# Altium project pca10112.PrjPCB (part 3 of 5)

## Sheet pca10112_sheet6_connectors.SchDoc: PCA10112 - Connectors
size A3; Organization: Nordic Semiconductor; DocumentNumber: 6; Revision: 1.1.0; SheetNumber: 6; SheetTotal: 8; Author: HANY; CompanyName: Nordic Semiconductor; ProjectName: pca10112.PrjPCB
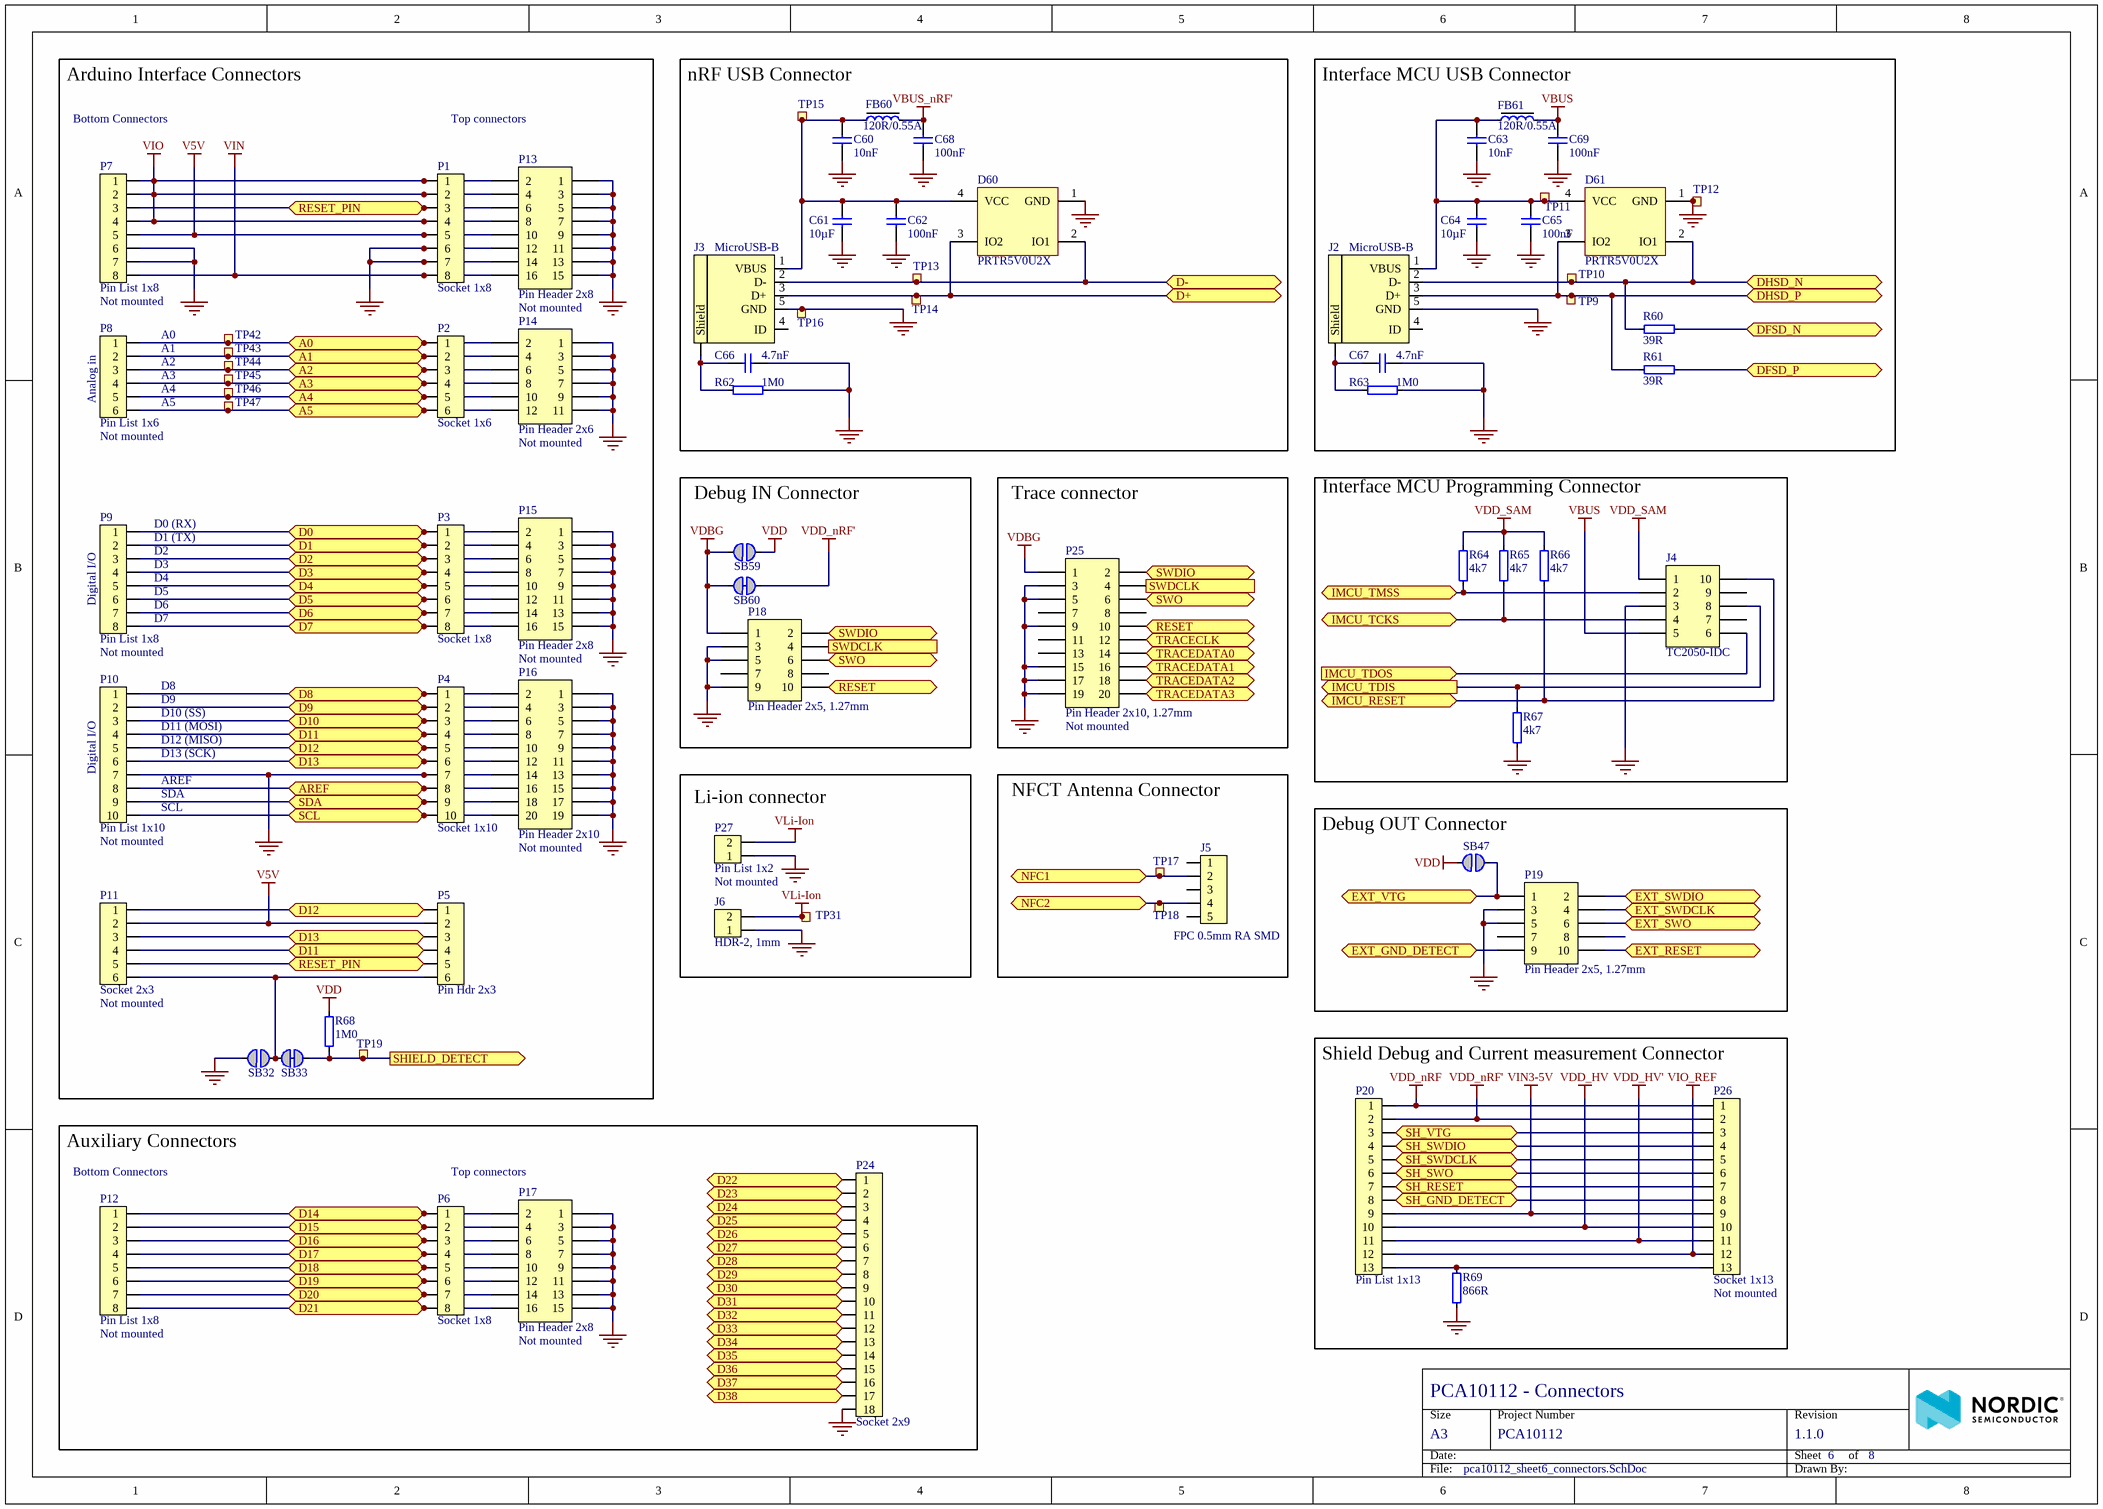
[diagram p5: pca10112_sheet6_connectors.SchDoc]

### Parts
C60  10nF  [CAPC0603X03L_C]
C61  10µF  [CAPC1608X06L]
C62  100nF  [CAPC0603X03L_C]
C63  10nF  [CAPC0603X03L_C]
C64  10µF  [CAPC1608X06L]
C65  100nF  [CAPC0603X03L_C]
C66  4.7nF  [CAPC0603X03L_C]
C67  4.7nF  [CAPC0603X03L_C]
C68  100nF  [CAPC0603X03L_C]
C69  100nF  [CAPC0603X03L_C]
D60  PRTR5V0U2X  [SOT190P230X110-4L]
D61  PRTR5V0U2X  [SOT190P230X110-4L]
FB60  120R/0.55A  [INDC1005X04L]
FB61  120R/0.55A  [INDC1005X04L]
J2  MicroUSB-B  [USB-Micro-B-RA-SMD-PiP]
J3  MicroUSB-B  [USB-Micro-B-RA-SMD-PiP]
J4  TC2050-IDC  [TC2050-IDC-NLFP]  (no BOM)
J5  FPC 0.5mm RA SMD  [FPC_05P-0.5mm-RA-SMD]
J6  HDR-2, 1mm  [SM02B-SRSS-TB]
P1  Socket 1x8  [SOCKET_1x8_SMD]
P2  Socket 1x6  [SOCKET_1x6_SMD]
P3  Socket 1x8  [SOCKET_1x8_SMD]
P4  Socket 1x10  [SOCKET_1x10_SMD]
P5  Pin Hdr 2x3  [HDR_2x3-SMD]
P6  Socket 1x8  [SOCKET_1x8_SMD]
P7  Pin List 1x8  Assembly: Not mounted  [LIST_1x8_SMD-NC]
P8  Pin List 1x6  Assembly: Not mounted  [LIST_1x6_SMD-NC]
P9  Pin List 1x8  Assembly: Not mounted  [LIST_1x8_SMD-NC]
P10  Pin List 1x10  Assembly: Not mounted  [LIST_1x10_SMD-NC]
P11  Socket 2x3  Assembly: Not mounted  [SOCKET_2x3_SMD-2.54mm-bottom-NC]
P12  Pin List 1x8  Assembly: Not mounted  [LIST_1x8_SMD-NC]
P13  Pin Header 2x8  Assembly: Not mounted  [HDR_2x8-NC]
P14  Pin Header 2x6  Assembly: Not mounted  [HDR_2x6-NC]
P15  Pin Header 2x8  Assembly: Not mounted  [HDR_2x8-NC]
P16  Pin Header 2x10  Assembly: Not mounted  [HDR_2x10-NC]
P17  Pin Header 2x8  Assembly: Not mounted  [HDR_2x8-NC]
P18  Pin Header 2x5, 1.27mm  [HDR_2x5-SMD-1.27mm-K]
P19  Pin Header 2x5, 1.27mm  [HDR_2x5-SMD-1.27mm-K]
P20  Pin List 1x13  [LIST_1x13_SMD]
P24  Socket 2x9  [SOCKET_2x9_SMD-2.54mm]
P25  Pin Header 2x10, 1.27mm  Assembly: Not mounted  [HDR_2x10-SMD-1.27mm-NC]
P26  Socket 1x13  Assembly: Not mounted  [LIST_1x13_SMD-NC]
P27  Pin List 1x2  Assembly: Not mounted  [LIST_1x2-NC]
R60  39R  [RESC0603X03L_C]
R61  39R  [RESC0603X03L_C]
R62  1M0  [RESC0603X03L_C]
R63  1M0  [RESC0603X03L_C]
R64  4k7  [RESC0603X03L_C]
R65  4k7  [RESC0603X03L_C]
R66  4k7  [RESC0603X03L_C]
R67  4k7  [RESC0603X03L_C]
R68  1M0  [RESC0603X03L_C]
R69  866R  [RESC0603X03L_C]
SB32  Solderbridge  [Solderbridge]  (value not drawn)  (no BOM)
SB33  Solderbridge  [Solderbridge_Shorted]  (value not drawn)  (net tie, no BOM)
SB47  Solderbridge  [Solderbridge]  (value not drawn)  (no BOM)
SB59  Solderbridge  [Solderbridge]  (value not drawn)  (no BOM)
SB60  Solderbridge  [Solderbridge_Shorted]  (value not drawn)  (net tie, no BOM)
TP9  Ø1.0mm,SMD  [TP_SMD_Ø1.0mm]  (value not drawn)  (no BOM)
TP10  Ø1.0mm,SMD  [TP_SMD_Ø1.0mm]  (value not drawn)  (no BOM)
TP11  Ø1.0mm,SMD  [TP_SMD_Ø1.0mm]  (value not drawn)  (no BOM)
TP12  Ø1.0mm,SMD  [TP_SMD_Ø1.0mm]  (value not drawn)  (no BOM)
TP13  Ø1.5mm,SMD  [TP_SMD_Ø1.5mm]  (value not drawn)  (no BOM)
TP14  Ø1.5mm,SMD  [TP_SMD_Ø1.5mm]  (value not drawn)  (no BOM)
TP15  Ø1.5mm,SMD  [TP_SMD_Ø1.5mm]  (value not drawn)  (no BOM)
TP16  Ø1.5mm,SMD  [TP_SMD_Ø1.5mm]  (value not drawn)  (no BOM)
TP17  Ø1.0mm,SMD  [TP_SMD_Ø1.0mm]  (value not drawn)  (no BOM)
TP18  Ø1.0mm,SMD  [TP_SMD_Ø1.0mm]  (value not drawn)  (no BOM)
TP19  Ø1.0mm,SMD  [TP_SMD_Ø1.0mm]  (value not drawn)  (no BOM)
TP31  Ø1.0mm,SMD  [TP_SMD_Ø1.0mm]  (value not drawn)  (no BOM)
TP42  Ø1.0mm,SMD  [TP_SMD_Ø1.0mm]  (value not drawn)  (no BOM)
TP43  Ø1.0mm,SMD  [TP_SMD_Ø1.0mm]  (value not drawn)  (no BOM)
TP44  Ø1.0mm,SMD  [TP_SMD_Ø1.0mm]  (value not drawn)  (no BOM)
TP45  Ø1.0mm,SMD  [TP_SMD_Ø1.0mm]  (value not drawn)  (no BOM)
TP46  Ø1.0mm,SMD  [TP_SMD_Ø1.0mm]  (value not drawn)  (no BOM)
TP47  Ø1.0mm,SMD  [TP_SMD_Ø1.0mm]  (value not drawn)  (no BOM)

### Blocks framed on the sheet
Arduino Interface Connectors: P1-P5 P7-P11 P13-P16 R68 SB32 SB33 TP19 TP42-TP47
nRF USB Connector: C60-C62 C66 C68 D60 FB60 J3 R62 TP13-TP16
Interface MCU USB Connector: C63-C65 C67 C69 D61 FB61 J2 R60 R61 R63 TP9-TP12
Debug IN Connector: P18 SB59 SB60
Trace connector: P25
Interface MCU Programming Connector: J4 R64-R67
Li-ion connector: J6 P27 TP31
NFCT Antenna Connector: J5 TP17 TP18
Debug OUT Connector: P19 SB47
Shield Debug and Current measurement Connector: P20 P26 R69
Auxiliary Connectors: P6 P12 P17 P24

### Ports
A0 (bidir), A1 (bidir), A2 (bidir), A3 (bidir), A4 (bidir), A5 (bidir), AREF (bidir), D0 (bidir), D1 (bidir), D2 (bidir), D3 (bidir), D4 (bidir), D5 (bidir), D6 (bidir), D7 (bidir), D8 (bidir), D9 (bidir), D10 (bidir), D11 (bidir), D12 (bidir), D13 (bidir), D14 (bidir), D15 (bidir), D16 (bidir), D17 (bidir), D18 (bidir), D19 (bidir), D20 (bidir), D21 (bidir), D22 (bidir), D23 (bidir), D24 (bidir), D25 (bidir), D26 (bidir), D27 (bidir), D28 (bidir), D29 (bidir), D30 (bidir), D31 (bidir), D32 (bidir), D33 (bidir), D34 (bidir), D35 (bidir), D36 (bidir), D37 (bidir), D38 (bidir), D+ (bidir), D- (bidir), DFSD_N (bidir), DFSD_P (bidir), DHSD_N (bidir), DHSD_P (bidir), EXT_GND_DETECT (bidir), EXT_RESET (bidir), EXT_SWDCLK (bidir), EXT_SWDIO (bidir), EXT_SWO (bidir), EXT_VTG (bidir), IMCU_RESET (bidir), IMCU_TCKS (bidir), IMCU_TDIS (out), IMCU_TDOS (in), IMCU_TMSS (bidir), NFC1 (bidir), NFC2 (bidir), RESET (bidir), RESET_PIN (bidir), SCL (bidir), SDA (bidir), SH_GND_DETECT (bidir), SH_RESET (bidir), SH_SWDCLK (bidir), SH_SWDIO (bidir), SH_SWO (bidir), SH_VTG (bidir), SHIELD_DETECT (out), SWDCLK (out), SWDIO (bidir), SWO (bidir), TRACECLK (bidir), TRACEDATA0 (bidir), TRACEDATA1 (bidir), TRACEDATA2 (bidir), TRACEDATA3 (bidir)

### Nets
GND: C60.1 C61.1 C62.1 C63.2 C64.1 C65.1 C66.1 C67.1 C68.1 C69.1 D60.1(GND) D61.1(GND) J2.5(GND) J3.5(GND) J4.3 J6.1 P1.6 P1.7 P4.7 P7.6 P7.7 P10.7 P13.1 P13.3 P13.5 P13.7 P13.9 P13.11 P13.12 P13.13 P13.14 P13.15 P14.1 P14.3 P14.5 P14.7 P14.9 P14.11 P15.1 P15.3 P15.5 P15.7 P15.9 P15.11 P15.13 P15.15 P16.1 P16.3 P16.5 P16.7 P16.9 P16.11 P16.13 P16.14 P16.15 P16.17 P16.19 P17.1 P17.3 P17.5 P17.7 P17.9 P17.11 P17.13 P17.15 P18.3 P18.5 P18.9 P19.3 P19.5 P24.18 P25.3 P25.5 P25.9 P25.15 P25.17 P25.19 P27.1 R62.1 R63.1 R67.2 R69.1 SB32.1 TP12.1 TP16.1
V5V: P1.5 P5.2 P7.5 P11.2 P13.10
VBUS: C69.2 FB61.2 J4.5
VBUS_nRF': C68.2 FB60.2
VDBG: P18.1 P25.1 SB59.1 SB60.1
VDD: R68.2 SB47.1 SB59.2
VDD_HV: P20.10 P26.10
VDD_HV': P20.11 P26.11
VDD_nRF: P20.1 P26.1
VDD_nRF': P20.2 P26.2 SB60.2
VDD_SAM: J4.1 R64.2 R65.2 R66.2
VIN: P1.8 P7.8 P13.16
VIN3-5V: P20.9 P26.9
VIO: P1.1 P1.2 P1.4 P7.1 P7.2 P7.4 P13.2 P13.4 P13.8
VIO_REF: P20.12 P26.12
VLi-Ion: J6.2 P27.2 TP31.1
D20: P6.7 P12.7 P17.14 ; port D20
D21: P6.8 P12.8 P17.16 ; port D21
D_N: D60.2(IO1) J3.2(D-) TP13.1 ; port D-
D_P: D60.3(IO2) J3.3(D+) TP14.1 ; port D+
DFSD_N: R60.1 ; port DFSD_N
DFSD_P: R61.1 ; port DFSD_P
DHSD_N: D61.2(IO1) J2.2(D-) R60.2 TP10.1 ; port DHSD_N
DHSD_P: D61.3(IO2) J2.3(D+) R61.2 TP9.1 ; port DHSD_P
EXT_GND_DETECT: P19.9 ; port EXT_GND_DETECT
EXT_RESET: P19.10 ; port EXT_RESET
EXT_SWDCLK: P19.4 ; port EXT_SWDCLK
EXT_SWDIO: P19.2 ; port EXT_SWDIO
EXT_SWO: P19.6 ; port EXT_SWO
EXT_VTG: P19.1 SB47.2 ; port EXT_VTG
IMCU_RESET: J4.10 R66.1 ; port IMCU_RESET
IMCU_TCKS: J4.4 R65.1 ; port IMCU_TCKS
IMCU_TDIS: J4.8 R67.1 ; port IMCU_TDIS
IMCU_TDOS: J4.6 ; port IMCU_TDOS
IMCU_TMSS: J4.2 R64.1 ; port IMCU_TMSS
NFC1: J5.2 TP17.1 ; port NFC1
NFC2: J5.4 TP18.1 ; port NFC2
P0.00: P6.1 P12.1 P17.2 ; port D14
P0.01: P6.2 P12.2 P17.4 ; port D15
P0.02/AIN0: P4.8 P10.8 P16.16 ; port AREF
P0.03/AIN1: P2.1 P8.1 P14.2 TP42.1 ; port A0
P0.04/AIN2: P2.2 P8.2 P14.4 TP43.1 ; port A1
P0.05/AIN3: P6.3 P12.3 P17.6 ; port D16
P0.06: P6.4 P12.4 P17.8 ; port D17
P0.07: P6.5 P12.5 P17.10 P25.12 ; port D18, port TRACECLK
P0.08: P6.6 P12.6 P17.12 ; port D19
P0.11: P24.1 P25.18 ; port D22, port TRACEDATA2
P0.12: P24.2 P25.16 ; port D23, port TRACEDATA1
P0.13: P24.3 ; port D24
P0.14: P24.4 ; port D25
P0.15: P24.5 ; port D26
P0.16: P24.6 ; port D27
P0.17: P24.7 ; port D28
P0.18/RESET: P18.10 P24.8 P25.10 ; port RESET, port D29
P0.19: P24.9 ; port D30
P0.20: P24.10 ; port D31
P0.21: P24.11 ; port D32
P0.22: P24.12 ; port D33
P0.23: P24.13 ; port D34
P0.24: P24.14 ; port D35
P0.25: P24.15 ; port D36
P0.28/AIN4: P2.3 P8.3 P14.6 TP44.1 ; port A2
P0.29/AIN5: P2.4 P8.4 P14.8 TP45.1 ; port A3
P0.30/AIN6: P2.5 P8.5 P14.10 TP46.1 ; port A4
P0.31/AIN7: P2.6 P8.6 P14.12 TP47.1 ; port A5
P1.00: P18.6 P24.16 P25.6 P25.14 ; port SWO, port D37, port TRACEDATA0
P1.01: P3.1 P9.1 P15.2 ; port D0
P1.02: P3.2 P9.2 P15.4 ; port D1
P1.03: P3.3 P9.3 P15.6 ; port D2
P1.04: P3.4 P9.4 P15.8 ; port D3
P1.05: P3.5 P9.5 P15.10 ; port D4
P1.06: P3.6 P9.6 P15.12 ; port D5
P1.07: P3.7 P9.7 P15.14 ; port D6
P1.08: P3.8 P9.8 P15.16 ; port D7
P1.09: P24.17 P25.20 ; port D38, port TRACEDATA3
P1.10: P4.1 P10.1 P16.2 ; port D8
P1.11: P4.2 P10.2 P16.4 ; port D9
P1.12: P4.3 P10.3 P16.6 ; port D10
P1.13: P4.4 P5.4 P10.4 P11.4 P16.8 ; port D11
P1.14: P4.5 P5.1 P10.5 P11.1 P16.10 ; port D12
P1.15: P4.6 P5.3 P10.6 P11.3 P16.12 ; port D13
RESET_PIN: P1.3 P5.5 P7.3 P11.5 P13.6 ; port RESET_PIN
SCL: P4.10 P10.10 P16.20 ; port SCL
SDA: P4.9 P10.9 P16.18 ; port SDA
SH_GND_DETECT: P20.8 P26.8 ; port SH_GND_DETECT
SH_RESET: P20.7 P26.7 ; port SH_RESET
SH_SWDCLK: P20.5 P26.5 ; port SH_SWDCLK
SH_SWDIO: P20.4 P26.4 ; port SH_SWDIO
SH_SWO: P20.6 P26.6 ; port SH_SWO
SH_VTG: P20.3 P26.3 ; port SH_VTG
SHIELD_DETECT: R68.1 SB33.2 TP19.1 ; port SHIELD_DETECT
SWDCLK: P18.4 P25.4 ; port SWDCLK
SWDIO: P18.2 P25.2 ; port SWDIO
NetC60_2: C60.2 C61.2 C62.2 D60.4(VCC) FB60.1 J3.1(VBUS) TP15.1
NetC63_1: C63.1 C64.2 C65.2 D61.4(VCC) FB61.1 J2.1(VBUS) TP11.1
NetC66_2: C66.2 J3.6(Shield) R62.2
NetC67_2: C67.2 J2.6(Shield) R63.2
NetP5_6: P5.6 P11.6 SB32.2 SB33.1
NetP20_13: P20.13 P26.13 R69.2

Not connected (* = marked no-connect by the designer): J2 4(ID); J3 4(ID); J4 7 9; J5 1 3 5; P18 7 8; P19 7 8; P25 7 8 11 13

### Notes on the sheet
- Bottom Connectors
- Top connectors
- (near P8) A0
- (near P8) A1
- (near P8) A2
- (near P8) A3
- (near P8) Analog in
- (near P8) A4
- (near P8) A5
- (near P9) D0 (RX)
- (near P9) D1 (TX)
- (near P9) D2
- (near P9) D3
- (near P9) D4
- (near P9) Digital I/O
- (near P9) D5
- (near P9) D6
- (near P9) D7
- (near P10) D8
- (near P10) D9
- (near P10) D10 (SS)
- (near P10) Digital I/O
- (near P10) AREF
- (near P10) D11 (MOSI)
- (near P10) D12 (MISO)
- (near P10) D13 (SCK)
- (near P10) SDA
- (near P10) SCL
- (near P12) Bottom Connectors
- Size
- Date:
- Project Number
- Sheet         of
- Revision
- File:
- Drawn By:

### Library data of the parts
C60 C63 = C0201-10n: Capacitor, X7R, ±10%; Manufacturer: N.A.; Part number IPS: 00000003480; Note: 10V; Pad Count: 2; Part Number: C0201-10n; Manufacturer Part Number: N.A.; LatestRevisionDate: 2017-11-09; Pin Count: 2; Publisher: Nordic Semiconductor; Published: 2014-11-13; Value: 10nF; Artikkelnr Noca: N.A.; Footprint Doc: 0201; ComponentLink1URL: N.A.; ComponentLink1Description: Datasheet; ComponentLink2URL: N.A.; ComponentLink2Description: Supplier link; HelpURL: N.A.; Supplier 1: N.A.; Supplier Part Number 1: N.A.; Supplier 2: N.A.; Supplier Part Number 2: N.A.; Component Class: Capacitors; PartId: 100200067; Author: rsk; Part number Norautron: N.A.
C61 C64 = C0603-10µ: Capacitor, X5R, ±20%; Manufacturer: N.A.; Part number IPS: 00000007785; Note: 6.3V; Artikkelnr Noca: 20039234; Pad Count: 2; Part Number: C0603-10µ; Manufacturer Part Number: N.A.; LatestRevisionDate: 2011-01-17; Pin Count: 2; Publisher: Nordic Semiconductor; Published: 2011-01-17; Value: 10µF; Footprint Doc: 0603; ComponentLink1URL: N.A.; ComponentLink1Description: Datasheet; ComponentLink2URL: N.A.; ComponentLink2Description: Supplier link; HelpURL: N.A.; Supplier 1: N.A.; Supplier Part Number 1: N.A.; Supplier 2: N.A.; Supplier Part Number 2: N.A.; Component Class: Capacitors; PartId: 100200275; Author: rsk; Part number Norautron: N.A.
C62 C65 C68 C69 = C0201-100n: Capacitor, X5R, ±10%; Manufacturer: N.A.; Part number IPS: 00000001248, 00000002505; Note: 16V; Pad Count: 2; Part Number: C0201-100n; Manufacturer Part Number: N.A.; LatestRevisionDate: 2017-11-09; Pin Count: 2; Publisher: Nordic Semiconductor; Published: 2014-11-13; Value: 100nF; Artikkelnr Noca: N.A.; Footprint Doc: 0201; ComponentLink1URL: N.A.; ComponentLink1Description: Datasheet; ComponentLink2URL: N.A.; ComponentLink2Description: Supplier link; HelpURL: N.A.; Supplier 1: N.A.; Supplier Part Number 1: N.A.; Supplier 2: N.A.; Supplier Part Number 2: N.A.; Component Class: Capacitors; PartId: 100200078; Author: rsk; Part number Norautron: N.A.
C66 C67 = C0201-4n7: Chip Cap 0201; Manufacturer: N.A.; Part number IPS: 00000001243; Note: Chip Cap 1%; Pad Count: 2; Part Number: C0201-4n7; Manufacturer Part Number: N.A.; LatestRevisionDate: 2020-10-13; Pin Count: 2; Publisher: Nordic Semiconductor; Published: 2014-11-13; Value: 4.7nF; Artikkelnr Noca: N.A.; Footprint Doc: 0201; ComponentLink1URL: N.A.; ComponentLink1Description: Datasheet; ComponentLink2URL: N.A.; ComponentLink2Description: Supplier link; HelpURL: N.A.; Supplier 1: N.A.; Supplier Part Number 1: N.A.; Supplier 2: N.A.; Supplier Part Number 2: N.A.; Component Class: Capacitors; PartId: 100200063; Author: rsk; Part number Norautron: N.A.
D60 D61 = PRTR5V0U2X: Ultra low capacitance double rail-to-rail ESD protection diode; Manufacturer: NXP Semiconductors; Part number IPS: 00000009951; Note: N.A.; Artikkelnr Noca: 10069015; Pad Count: 4; Part Number: PRTR5V0U2X; Manufacturer Part Number: PRTR5V0U2X; LatestRevisionDate: 2017-11-09; Publisher: Nordic Semiconductor; Published: 2012-06-11; Value: PRTR5V0U2X; Footprint Doc: SOT-143B; ComponentLink1URL: N.A.; ComponentLink1Description: Datasheet; ComponentLink2URL: N.A.; ComponentLink2Description: Supplier link; HelpURL: http://www.farnell.com/datasheets/109718.pdf; Pin Count: 4; Supplier 1: Digi-Key; Supplier Part Number 1: 568-4140-1-ND; Supplier 2: Farnell; Supplier Part Number 2: 152-4157; Component Class: Semiconductors; PartId: 101300082; Author: rsk; Part number Norautron: N.A.
FB60 FB61 = FB0402-120R@100M-500mA: Ferrite Bead, 120 Ohm @ 100MHz, 500mA, 250 mOhm Max; Manufacturer: Murata; Manufacturer Part Number: BLM15AG121SN1D; Part number IPS: 00000009954; Part number Norautron: N.A.; Note: Chip EMIFIL Inductor Type Chip Ferrite Bead; Artikkelnr Noca: 33029317; Pad Count: 2; Part Number: FB0402-120R@100M-500mA; Footprint Doc: 0402; LatestRevisionDate: 2014-01-10; Pin Count: 2; Publisher: Nordic Semiconductor; Published: 2011-11-14; Value: 120R/0.55A; ComponentLink1Description: Datasheet; ComponentLink2Description: Supplier link; ComponentLink1URL: N.A.; ComponentLink2URL: N.A.; HelpURL: http://search.murata.co.jp/Ceramy/image/img/PDF/ENG/L0110S0100BLM15A_SN.pdf; Supplier 1: Digi-Key; Supplier Part Number 1: 490-1005-1-ND; Supplier 2: Farnell; Supplier Part Number 2: 151-5760; Component Class: Inductors; PartId: 100300099; Author: rsk
J2 J3 = USB-Micro-B-RA-SMD-PiP: MicroUSB-B-SMT; Manufacturer: Allen Creations Corp.; Manufacturer Part Number: AJU55-BS2111-L; Part number IPS: 00000007790; Note: N.A.; Artikkelnr Noca: 55029020; Pad Count: 5; Part Number: USB-Micro-B-RA-SMD-PiP; Footprint Doc: USB-Micro-B-RA-SMD-PiP; LatestRevisionDate: 2016-04-21; Pin Count: 5; Publisher: Nordic Semiconductor; Published: 2014-10-07; Value: MicroUSB-B; ComponentLink1URL: N.A.; ComponentLink1Description: Datasheet; ComponentLink2URL: N.A.; ComponentLink2Description: Supplier link; HelpURL: \\hizz\pro\app9717\Datasheet\connectors\Allen Creations Corp\AJU-211.pdf; Supplier 1: Cabcon; Supplier Part Number 1: AJU55-BS2111-L; Supplier 2: Digi-Key; Supplier Part Number 2: 609-4616-1-ND; Component Class: Connectors; PartId: 100500490; Author: rsk; Part number Norautron: N.A.
J4 = TC2050-IDC-NLFP: CBL PLUG-OF-NAILS 10-PIN; Manufacturer: Tag-Connect LLC; Artikkelnr Noca: N.A.; Pad Count: 10; Part Number: TC2050-IDC-NLFP; Manufacturer Part Number: TC2050-IDC-NLFP; LatestRevisionDate: 2012-11-21; Publisher: Nordic Semiconductor; Published: 2012-11-21; Value: TC2050-IDC; Pin Count: 10; Footprint Doc: TC2050-IDC-NLFP; Part number IPS: N.A.; ComponentLink1URL: N.A.; ComponentLink1Description: Datasheet; ComponentLink2URL: N.A.; ComponentLink2Description: Supplier link; HelpURL: http://www.tag-connect.com/Materials/TC2050-IDC%20Datasheet.pdf; Supplier 1: Digi-Key; Supplier Part Number 1: TC2050-IDC-NL-ND; Supplier 2: N.A.; Supplier Part Number 2: N.A.; Component Class: Connectors; Note: N.A.; PartId: 100500463; Author: rsk; Part number Norautron: N.A.
J5 = FPC_05P-0.5mm-RA-SMD: 0.5mm FPC, 5P,Right Angle SMT,Double Contact,H=1.2mm,White, Tin plated; Manufacturer: W-CON; Manufacturer Part Number: 5141-05RZDNWR01; Part number IPS: 00000007792; Note: N.A.; Artikkelnr Noca: 55010020; Pad Count: 7; Part Number: FPC_05P-0.5mm-RA-SMD; Footprint Doc: FPC_05P-0.5mm-RA-SMD; LatestRevisionDate: 2016-04-21; Pin Count: 7; Publisher: Nordic Semiconductor; Published: 2015-06-22; Value: FPC 0.5mm RA SMD; ComponentLink1URL: N.A.; ComponentLink1Description: Datasheet; ComponentLink2URL: N.A.; ComponentLink2Description: Supplier link; HelpURL: \\hizz\pro\app9717\Datasheet\connectors\W-CON\5141-XXRZDNXX0X.pdf; Supplier 1: Cabcon; Supplier Part Number 1: 5141-05RZDNWR01; Supplier 2: Digi-Key; Supplier Part Number 2: WM9836CT-ND; Component Class: Connectors; PartId: 100500528; Author: rsk; Part number Norautron: N.A.
J6 = SM02B-SRSS-TB: 1.0mm pitch connector side entry SMD; Manufacturer: JST Sales America Inc.; Manufacturer Part Number: SM02B-SRSS-TB(LF)(SN); Part number IPS: 00000007791; Part number Norautron: N.A.; Note: JST, Header; Artikkelnr Noca: 55010030; Pad Count: 2; Part Number: SM02B-SRSS-TB; Footprint Doc: SM02B-SRSS-TB; LatestRevisionDate: 2016-06-20; Pin Count: 2; Publisher: Nordic Semiconductor; Published: 2016-06-20; Value: HDR-2, 1mm; ComponentLink1URL: N.A.; ComponentLink1Description: Datasheet; ComponentLink2URL: N.A.; ComponentLink2Description: Supplier link; HelpURL: http://www.jst-mfg.com/product/pdf/eng/eSH.pdf; Supplier 1: Cabcon; Supplier Part Number 1: SM02B-SRSS-TB(LF)(SN); Supplier 2: Digi-Key; Supplier Part Number 2: 455-1802-1-ND; Component Class: Connectors; PartId: 100500383; Author: rsk
P1 P3 P6 = Socket 1x8 SMD: Socket 1x8, 2.54mm (100mil), SMD; Manufacturer: W-CON; Manufacturer Part Number: 2171-108MS0CUNR1; Part number IPS: 00000009963; Note: N.A.; Artikkelnr Noca: 55030002; Pad Count: 8; Part Number: Socket 1x8 SMD; Footprint Doc: SOCKET_1x8_SMD; LatestRevisionDate: 2017-10-23; Pin Count: 8; Publisher: Nordic Semiconductor; Published: 2016-01-22; Value: Socket 1x8; ComponentLink1URL: N.A.; ComponentLink1Description: Datasheet; ComponentLink2URL: N.A.; ComponentLink2Description: Supplier link; HelpURL: N.A.; Supplier 1: Cabcon; Supplier Part Number 1: 2171-108MS0CUNR1; Supplier 2: Samtec; Supplier Part Number 2: SSM-108-F-SV-P-TR; Component Class: Connectors; PartId: 100500412; Author: rsk; Part number Norautron: N.A.
P2 = Socket 1x6 SMD: Socket 1x6, 2.54mm (100mil), SMD; Manufacturer: W-CON; Manufacturer Part Number: 2171-106MS0CUNR1; Part number IPS: 00000009964; Note: N.A.; Artikkelnr Noca: 55030001; Pad Count: 6; Part Number: Socket 1x6 SMD; Footprint Doc: SOCKET_1x6_SMD; LatestRevisionDate: 2017-10-23; Pin Count: 6; Publisher: Nordic Semiconductor; Published: 2016-01-22; Value: Socket 1x6; ComponentLink1URL: N.A.; ComponentLink1Description: Datasheet; ComponentLink2URL: N.A.; ComponentLink2Description: Supplier link; HelpURL: N.A.; Supplier 1: Cabcon; Supplier Part Number 1: 2171-106MS0CUNR1; Supplier 2: Samtec; Supplier Part Number 2: SSM-106-F-SV-P-TR; Component Class: Connectors; PartId: 100500408; Author: rsk; Part number Norautron: N.A.
P4 = Socket 1x10 SMD: Socket 1x10, 2.54mm (100mil), SMD; Manufacturer: W-CON; Manufacturer Part Number: 2171-110MS0CUNR1; Part number IPS: 00000009965; Note: N.A.; Artikkelnr Noca: 55030004; Pad Count: 10; Part Number: Socket 1x10 SMD; Footprint Doc: SOCKET_1x10_SMD; LatestRevisionDate: 2016-01-22; Pin Count: 10; Publisher: Nordic Semiconductor; Published: 2016-01-22; Value: Socket 1x10; ComponentLink1URL: N.A.; ComponentLink1Description: Datasheet; ComponentLink2URL: N.A.; ComponentLink2Description: Supplier link; HelpURL: N.A.; Supplier 1: Cabcon; Supplier Part Number 1: 2171-110MS0CUNR1; Supplier 2: Samtec; Supplier Part Number 2: SSM-110-F-SV-P-TR; Component Class: Connectors; PartId: 100500416; Author: rsk; Part number Norautron: N.A.
P5 = Pin Header 2x3 SMD: Pin Header 2x3, 2.54mm (100mil) SMD; Manufacturer: W-CON; Manufacturer Part Number: 1125-1203S0M116R1; Part number IPS: 00000009966; Part number Norautron: N.A.; Artikkelnr Noca: 55010007; Pad Count: 6; Part Number: Pin Header 2x3 SMD; Footprint Doc: HDR_2x3-SMD; LatestRevisionDate: 2016-01-22; Pin Count: 6; Publisher: Nordic Semiconductor; Published: 2016-01-22; Value: Pin Hdr 2x3; Note: SMD; ComponentLink1URL: N.A.; ComponentLink1Description: Datasheet; ComponentLink2URL: N.A.; ComponentLink2Description: Supplier link; HelpURL: \\hizz\pro\app9717\Datasheet\connectors\W-CON\1125-12XXXXMXXXXX.PDF; Supplier 1: Cabcon; Supplier Part Number 1: 1125-1203S0M116R1; Supplier 2: Samtec; Supplier Part Number 2: TSM-103-01-L-DV; Component Class: Connectors; PartId: 100500242; Author: rsk
P7 P9 P12 = Pin List 1x8 SMD, N.C.: Pin List 1x8, 2.54mm (100mil), SMD; Manufacturer: W-CON; Manufacturer Part Number: 1125-1108S0M116R2; Note: N.A.; Artikkelnr Noca: 55010006; Pad Count: 8; Part Number: Pin List 1x8 SMD, N.C.; LatestRevisionDate: 2016-01-22; Publisher: Nordic Semiconductor; Published: 2016-01-22; Value: Pin List 1x8; Pin Count: 8; Footprint Doc: LIST_1x8_SMD; Part number IPS: N.A.; ComponentLink1URL: N.A.; ComponentLink1Description: Datasheet; ComponentLink2URL: N.A.; ComponentLink2Description: Supplier link; HelpURL: \\hizz\pro\app9717\Datasheet\connectors\W-CON\1125-11XXXXMXXXXX.pdf; Supplier 1: Cabcon; Supplier Part Number 1: 1125-1108S0M116R2; Supplier 2: Samtec; Supplier Part Number 2: TSM-108-01-L-SV-P-TR; Component Class: Connectors; PartId: 100500330; Author: rsk; Part number Norautron: N.A.
P8 = Pin List 1x6 SMD, N.C.: Pin List 1x6, 2.54mm (100mil), SMD; Manufacturer: W-CON; Manufacturer Part Number: 1125-1106S0M116R2; Note: N.A.; Artikkelnr Noca: 55010026; Pad Count: 6; Part Number: Pin List 1x6 SMD, N.C.; LatestRevisionDate: 2016-03-29; Pin Count: 6; Publisher: Nordic Semiconductor; Published: 2016-03-29; Value: Pin List 1x6; Footprint Doc: LIST_1x6_SMD; Part number IPS: N.A.; ComponentLink1URL: N.A.; ComponentLink1Description: Datasheet; ComponentLink2URL: N.A.; ComponentLink2Description: Supplier link; HelpURL: \\hizz\pro\app9717\Datasheet\connectors\W-CON\1125-11XXXXMXXXXX.pdf; Supplier 1: Cabcon; Supplier Part Number 1: 1125-1106S0M116R2; Supplier 2: Samtec; Supplier Part Number 2: TSM-106-01-L-SV-P-TR; Component Class: Connectors; PartId: 100500321; Author: rsk; Part number Norautron: N.A.
P10 = Pin List 1x10 SMD, N.C.: Pin List 1x10, 2.54mm (100mil), SMD; Manufacturer: W-CON; Manufacturer Part Number: 1125-1110S0M116R2; Note: N.A.; Artikkelnr Noca: 55010028; Pad Count: 10; Part Number: Pin List 1x10 SMD, N.C.; LatestRevisionDate: 2016-03-29; Publisher: Nordic Semiconductor; Published: 2016-03-29; Value: Pin List 1x10; Pin Count: 10; Footprint Doc: LIST_1x10_SMD; Part number IPS: N.A.; ComponentLink1URL: N.A.; ComponentLink1Description: Datasheet; ComponentLink2URL: N.A.; ComponentLink2Description: Supplier link; HelpURL: \\hizz\pro\app9717\Datasheet\connectors\W-CON\1125-11XXXXMXXXXX.pdf; Supplier 1: Cabcon; Supplier Part Number 1: 1125-1110S0M116R2; Supplier 2: Samtec; Supplier Part Number 2: TSM-110-01-L-SV-P-TR; Component Class: Connectors; PartId: 100500338; Author: rsk; Part number Norautron: N.A.
P11 = Socket 2x3 SMD Bottom, N.C.: Socket 2x3, 2.54mm (100mil), SMD; Manufacturer: W-CON; Manufacturer Part Number: 2171-203MS0CUNR1; Note: N.A.; Artikkelnr Noca: 55030010; Pad Count: 6; Part Number: Socket 2x3 SMD Bottom, N.C.; LatestRevisionDate: 2016-03-29; Pin Count: 6; Publisher: Nordic Semiconductor; Published: 2014-06-10; Value: Socket 2x3; Footprint Doc: SOCKET_2x3_SMD-2.54mm-bottom; Part number IPS: N.A.; ComponentLink1URL: N.A.; ComponentLink1Description: Datasheet; ComponentLink2URL: N.A.; ComponentLink2Description: Supplier link; HelpURL: \\hizz\pro\app9717\Datasheet\connectors\W-CON\2171-2XXMXXCUNXX.pdf; Supplier 1: Cabcon; Supplier Part Number 1: 2171-203MS0CUNR1; Supplier 2: Samtec; Supplier Part Number 2: SSM-103-F-DV-P-TR; Component Class: Connectors; PartId: 100500434; Author: rsk; Part number Norautron: N.A.
P13 P15 P17 = Pin Header 2x8, N.C.: Pin Header 2x8, 2.54mm (100mil); Manufacturer: N.A.; Pad Count: 16; Part Number: Pin Header 2x8, N.C.; Manufacturer Part Number: N.A.; Footprint Doc: HDR_2x8; LatestRevisionDate: 2009-12-12; Pin Count: 16; Publisher: Nordic Semiconductor; Published: 2009-12-12; Value: Pin Header 2x8; Note: N.A.; Artikkelnr Noca: N.A.; Part number IPS: N.A.; ComponentLink1URL: N.A.; ComponentLink1Description: Datasheet; ComponentLink2URL: N.A.; ComponentLink2Description: Supplier link; HelpURL: N.A.; Supplier 1: N.A.; Supplier Part Number 1: N.A.; Supplier 2: N.A.; Supplier Part Number 2: N.A.; Component Class: Connectors; PartId: 100500270; Author: rsk; Part number Norautron: N.A.
P14 = Pin Header 2x6, N.C.: Pin Header 2x6, 2.54mm (100mil); Manufacturer: N.A.; Pad Count: 12; Part Number: Pin Header 2x6, N.C.; Manufacturer Part Number: N.A.; Footprint Doc: HDR_2x6; LatestRevisionDate: 2014-07-04; Pin Count: 12; Publisher: Nordic Semiconductor; Published: 2009-12-12; Value: Pin Header 2x6; Note: N.A.; Artikkelnr Noca: N.A.; Part number IPS: N.A.; ComponentLink1URL: N.A.; ComponentLink1Description: Datasheet; ComponentLink2URL: N.A.; ComponentLink2Description: Supplier link; HelpURL: N.A.; Supplier 1: N.A.; Supplier Part Number 1: N.A.; Supplier 2: N.A.; Supplier Part Number 2: N.A.; Component Class: Connectors; PartId: 100500265; Author: rsk; Part number Norautron: N.A.
P16 = Pin Header 2x10, N.C.: Pin Header 2x10, 2.54mm (100mil); Manufacturer: N.A.; Pad Count: 20; Part Number: Pin Header 2x10, N.C.; Manufacturer Part Number: N.A.; Footprint Doc: HDR_2x10; LatestRevisionDate: 2017-02-02; Pin Count: 20; Publisher: Nordic Semiconductor; Published: 2017-01-30; Value: Pin Header 2x10; Note: N.A.; Artikkelnr Noca: N.A.; Part number IPS: N.A.; ComponentLink1URL: N.A.; ComponentLink1Description: Datasheet; ComponentLink2URL: N.A.; ComponentLink2Description: Supplier link; HelpURL: N.A.; Supplier 1: N.A.; Supplier Part Number 1: N.A.; Supplier 2: N.A.; Supplier Part Number 2: N.A.; Component Class: Connectors; PartId: 100500274; Author: rsk; Part number Norautron: N.A.
P18 P19 = Pin Header 2x5 SMD, 1.27mm, KS: Pin Header 2x5, 1.27mm (50mil), SMD, Keying Shroud; Manufacturer: W-CON; Manufacturer Part Number: 3132-10MS0BK00R1; Part number IPS: 00000009968; Note: N.A.; Artikkelnr Noca: 55010009; Pad Count: 10; Part Number: Pin Header 2x5 SMD, 1.27mm, KS; Footprint Doc: HDR_2x5-SMD-1.27mm; LatestRevisionDate: 2016-04-21; Pin Count: 10; Publisher: Nordic Semiconductor; Published: 2016-01-22; Value: Pin Header 2x5, 1.27mm; ComponentLink1URL: N.A.; ComponentLink1Description: Datasheet; ComponentLink2URL: N.A.; ComponentLink2Description: Supplier link; HelpURL: \\hizz\pro\app9717\Datasheet\connectors\W-CON\3132-XXMXXBK00XX.pdf; Supplier 1: Cabcon; Supplier Part Number 1: 3132-10MS0BK00R1; Supplier 2: Samtec; Supplier Part Number 2: FTSH-105-01-F-DV-K; Component Class: Connectors; PartId: 100500261; Author: rsk; Part number Norautron: N.A.
P20 = Pin List 1x13 SMD: Pin List 1x13, 2.54mm (100mil), SMD; Manufacturer: N.A.; Part number IPS: 00000002499; Pad Count: 13; Part Number: Pin List 1x13 SMD; Manufacturer Part Number: N.A.; Footprint Doc: LIST_1x13_SMD; LatestRevisionDate: 2015-11-10; Pin Count: 13; Publisher: Nordic Semiconductor; Published: 2015-11-10; Value: Pin List 1x13; Note: N.A.; Artikkelnr Noca: N.A.; ComponentLink1URL: N.A.; ComponentLink1Description: Datasheet; ComponentLink2URL: N.A.; ComponentLink2Description: Supplier link; HelpURL: N.A.; Supplier 1: Cabcon; Supplier Part Number 1: 1125-1113S0M116R2; Supplier 2: Samtec; Supplier Part Number 2: TSM-113-01-L-SV-P-TR; Component Class: Connectors; PartId: 100500345; Author: rsk; Part number Norautron: N.A.
P24 = Socket 2x9 SMD: Socket 2x9, 2.54mm (100mil), SMD; Manufacturer: W-CON; Manufacturer Part Number: 2171-209MS0CUNR1; Part number IPS: 00000004367; Note: N.A.; Artikkelnr Noca: 55030011; Pad Count: 18; Part Number: Socket 2x9 SMD; Footprint Doc: SOCKET_2x9_SMD-2.54mm; LatestRevisionDate: 2017-10-23; Pin Count: 18; Publisher: Nordic Semiconductor; Published: 2016-07-07; Value: Socket 2x9; ComponentLink1URL: N.A.; ComponentLink1Description: Datasheet; ComponentLink2URL: N.A.; ComponentLink2Description: Supplier link; HelpURL: N.A.; Supplier 1: Cabcon; Supplier Part Number 1: 2171-209MS0CUNR1; Supplier 2: Samtec; Supplier Part Number 2: SSM-109-F-DV-P-TR; Component Class: Connectors; PartId: 100500440; Author: rsk; Part number Norautron: N.A.
P25 = Pin Header 2x10 SMD, 1.27mm, KS, N.C.: Pin Header 2x10, 1.27mm (50mil), SMD, Keying Shroud; Manufacturer: W-CON; Manufacturer Part Number: 3132-20MS0BK00R1; Note: N.A.; Pad Count: 20; Part Number: Pin Header 2x10 SMD, 1.27mm, KS, N.C.; LatestRevisionDate: 2017-10-23; Pin Count: 20; Publisher: Nordic Semiconductor; Published: 2017-09-07; Value: Pin Header 2x10, 1.27mm; Artikkelnr Noca: N.A.; Footprint Doc: HDR_2x10-SMD-1.27mm; Part number IPS: N.A.; ComponentLink1URL: N.A.; ComponentLink1Description: Datasheet; ComponentLink2URL: N.A.; ComponentLink2Description: Supplier link; HelpURL: N.A.; Supplier 1: Cabcon; Supplier Part Number 1: 3132-20MS0BK00R1; Supplier 2: Digi-Key; Supplier Part Number 2: FTSH-110-01-F-DV-K-ND; Component Class: Connectors; PartId: 100500279; Author: rsk; Part number Norautron: N.A.
P26 = Socket 1x13 SMD, N.C.: Socket 1x13, 2.54mm (100mil), SMD; Manufacturer: W-CON; Manufacturer Part Number: 2171-113MS0CUNR1; Note: N.A.; Pad Count: 13; Part Number: Socket 1x13 SMD, N.C.; Footprint Doc: SOCKET_1x13_SMD; LatestRevisionDate: 2019-05-27; Pin Count: 13; Publisher: Nordic Semiconductor; Published: 2019-05-27; Value: Socket 1x13; Artikkelnr Noca: N.A.; Part number IPS: N.A.; ComponentLink1URL: N.A.; ComponentLink1Description: Datasheet; ComponentLink2URL: N.A.; ComponentLink2Description: Supplier link; HelpURL: N.A.; Supplier 1: Cabcon; Supplier Part Number 1: 2171-113MS0CUNR1; Supplier 2: Samtec; Supplier Part Number 2: SSM-113-L-SV-P-TR; Component Class: Connectors; PartId: 100500422; Author: rsk; Part number Norautron: N.A.
P27 = Pin List 1x2, N.C.: Pin List 1x2, 2.54mm (100mil); Manufacturer: N.A.; Pad Count: 2; Part Number: Pin List 1x2, N.C.; Manufacturer Part Number: N.A.; Footprint Doc: LIST_1x2; LatestRevisionDate: 2017-02-02; Pin Count: 2; Publisher: Nordic Semiconductor; Published: 2017-01-30; Value: Pin List 1x2; Note: N.A.; Artikkelnr Noca: N.A.; Part number IPS: N.A.; ComponentLink1URL: N.A.; ComponentLink1Description: Datasheet; ComponentLink2URL: N.A.; ComponentLink2Description: Supplier link; HelpURL: N.A.; Supplier 1: N.A.; Supplier Part Number 1: N.A.; Supplier 2: N.A.; Supplier Part Number 2: N.A.; Component Class: Connectors; PartId: 100500298; Author: rsk; Part number Norautron: N.A.
R60 R61 = R0201-39R: Resistor, ±1%, 0.05W; Manufacturer: N.A.; Part number IPS: 00000001704; Note: Chip Res 1%; Pad Count: 2; Value: 39R; Part Number: R0201-39R; Manufacturer Part Number: N.A.; LatestRevisionDate: 2014-11-13; Pin Count: 2; Publisher: Nordic Semiconductor; Published: 2014-11-13; Artikkelnr Noca: N.A.; Footprint Doc: 0201; ComponentLink1URL: N.A.; ComponentLink1Description: Datasheet; ComponentLink2URL: N.A.; ComponentLink2Description: Supplier link; HelpURL: N.A.; Supplier 1: N.A.; Supplier Part Number 1: N.A.; Supplier 2: N.A.; Supplier Part Number 2: N.A.; Component Class: Resistors; PartId: 100100021; Author: rsk; Part number Norautron: N.A.
R62 R63 R68 = R0201-1M0: Resistor, ±1%, 0.05W; Manufacturer: N.A.; Part number IPS: 00000001418; Note: Chip Res 1%; Pad Count: 2; Part Number: R0201-1M0; Manufacturer Part Number: N.A.; ComponentLink1URL: N.A.; ComponentLink1Description: Datasheet; ComponentLink2URL: N.A.; ComponentLink2Description: Supplier link; HelpURL: N.A.; Footprint Doc: 0201; LatestRevisionDate: 2014-11-13; Pin Count: 2; Publisher: Nordic Semiconductor; Published: 2014-11-13; Value: 1M0; Supplier 1: N.A.; Supplier Part Number 1: N.A.; Supplier 2: N.A.; Supplier Part Number 2: N.A.; Artikkelnr Noca: N.A.; Component Class: Resistors; PartId: 100100093; Author: rsk; Part number Norautron: N.A.
R64-R67 = R0201-4k7: Resistor, ±1%, 0.05W; Manufacturer: N.A.; Part number IPS: 00000001706; Note: Chip Res 1%; Pad Count: 2; Part Number: R0201-4k7; Manufacturer Part Number: N.A.; LatestRevisionDate: 2014-11-13; Pin Count: 2; Publisher: Nordic Semiconductor; Published: 2014-11-13; Value: 4k7; Artikkelnr Noca: N.A.; Footprint Doc: 0201; ComponentLink1URL: N.A.; ComponentLink1Description: Datasheet; ComponentLink2URL: N.A.; ComponentLink2Description: Supplier link; HelpURL: N.A.; Supplier 1: N.A.; Supplier Part Number 1: N.A.; Supplier 2: N.A.; Supplier Part Number 2: N.A.; Component Class: Resistors; PartId: 100100061; Author: rsk; Part number Norautron: N.A.
R69 = R0201-866: Resistor, ±1%, 0.05W; Manufacturer: N.A.; Part number IPS: 00000004368; Note: Chip Res 1%; Pad Count: 2; Part Number: R0201-866; Manufacturer Part Number: N.A.; ComponentLink1URL: N.A.; ComponentLink1Description: Datasheet; ComponentLink2URL: N.A.; ComponentLink2Description: Supplier link; HelpURL: N.A.; Footprint Doc: 0201; LatestRevisionDate: 2019-07-16; Pin Count: 2; Publisher: Nordic Semiconductor; Published: 2019-07-16; Value: 866R; Artikkelnr Noca: N.A.; Supplier 1: N.A.; Supplier Part Number 1: N.A.; Supplier 2: N.A.; Supplier Part Number 2: N.A.; Component Class: Resistors; PartId: 100100042; Author: rsk; Part number Norautron: N.A.
SB32 SB47 SB59 = Solderbridge: Manufacturer: N.A.; Pad Count: 2; Part Number: Solderbridge; Manufacturer Part Number: N.A.; Footprint Doc: Solderbridge; LatestRevisionDate: 2009-12-14; Pin Count: 2; Publisher: Nordic Semiconductor; Published: 2009-12-14; Value: Solderbridge; Note: N.A.; Artikkelnr Noca: N.A.; Part number IPS: N.A.; ComponentLink1URL: N.A.; ComponentLink1Description: Datasheet; ComponentLink2URL: N.A.; ComponentLink2Description: Supplier link; HelpURL: N.A.; Supplier 1: N.A.; Supplier Part Number 1: N.A.; Supplier 2: N.A.; Supplier Part Number 2: N.A.; Component Class: Connectors; PartId: 100500458; Author: rsk; Part number Norautron: N.A.
SB33 SB60 = Solderbridge Shorted: Shorted Solderbridge; Manufacturer: N.A.; Pad Count: 2; Part Number: Solderbridge Shorted; Manufacturer Part Number: N.A.; Footprint Doc: Solderbridge_Shorted; LatestRevisionDate: 2012-08-07; Pin Count: 2; Publisher: Nordic Semiconductor; Published: 2012-08-07; Value: Solderbridge; Note: N.A.; Artikkelnr Noca: N.A.; Part number IPS: N.A.; ComponentLink1URL: N.A.; ComponentLink1Description: Datasheet; ComponentLink2URL: N.A.; ComponentLink2Description: Supplier link; HelpURL: N.A.; Supplier 1: N.A.; Supplier Part Number 1: N.A.; Supplier 2: N.A.; Supplier Part Number 2: N.A.; Component Class: Connectors; PartId: 100500459; Author: rsk; Part number Norautron: N.A.
TP9-TP12 TP17-TP19 TP31 TP42-TP47 = TP_SMD_Ø1.0MM: 1.0mm circular SMD testpad; Manufacturer: Nordic Semiconductor; Manufacturer Part Number: N.A.; Pad Count: 1; Part Number: TP_SMD_Ø1.0MM; LatestRevisionDate: 2021-03-05; Pin Count: 1; Publisher: Nordic Semiconductor; Published: 2013-06-11; Value: Ø1.0mm,SMD; Note: N.A.; Artikkelnr Noca: N.A.; Footprint Doc: TP_SMD_Ø1.0mm; Part number IPS: N.A.; ComponentLink1URL: N.A.; ComponentLink1Description: Datasheet; ComponentLink2URL: N.A.; ComponentLink2Description: Supplier link; HelpURL: N.A.; Supplier 1: N.A.; Supplier Part Number 1: N.A.; Supplier 2: N.A.; Supplier Part Number 2: N.A.; Component Class: Connectors; PartId: 100500475; Author: rsk; Part number Norautron: N.A.
TP13-TP16 = TP_SMD_Ø1.5MM: 1.0mm circular SMD testpad; Manufacturer: Nordic Semiconductor; Manufacturer Part Number: N.A.; Pad Count: 1; Part Number: TP_SMD_Ø1.5MM; LatestRevisionDate: 2021-03-05; Pin Count: 1; Publisher: Nordic Semiconductor; Published: 2016-06-02; Value: Ø1.5mm,SMD; Note: N.A.; Artikkelnr Noca: N.A.; Footprint Doc: TP_SMD_Ø1.5mm; Part number IPS: N.A.; ComponentLink1URL: N.A.; ComponentLink1Description: Datasheet; ComponentLink2URL: N.A.; ComponentLink2Description: Supplier link; HelpURL: N.A.; Supplier 1: N.A.; Supplier Part Number 1: N.A.; Supplier 2: N.A.; Supplier Part Number 2: N.A.; Component Class: Connectors; PartId: 100500477; Author: rsk; Part number Norautron: N.A.